# EasyEDA Pro project MP3416_DC-DC_5V.eprj

# Schematic MP3416_DC-DC
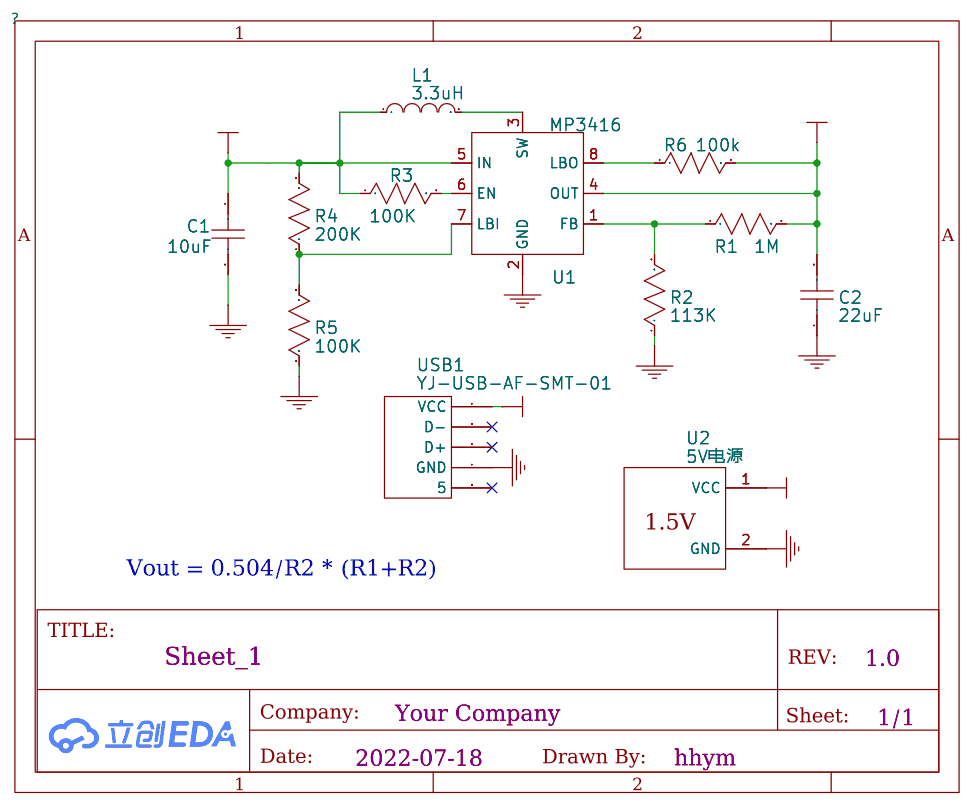
[diagram p0: schematic sheet]

## Parts
C1  10uF
C2  22uF
L1  3.3uH
R1  1M
R2  113K
R3  100K
R4  200K
R5  100K
R6  100k
U1  MP3416
U2  5V电源
USB1  YJ-USB-AF-SMT-01

## Library data of the parts
C1 C2 R1-R6 = undefined
L1 = undefined: Supplier: LCSC; Supplier Part: C718408; Manufacturer: YJYCOIN; Manufacturer Part: YSPI1365-3R3M; JLCPCB Part Class: Extended Part
U1 U2 = undefined: Supplier: LCSC
USB1 = undefined: Supplier: LCSC; Manufacturer: ValuePro; Supplier Part: C8328; JLCPCB Part Class: Extended Part

## Nets
+1.5V: C1.1 L1.1 R3.1 R4.2 U1.5(IN) U2.1(VCC)
+5V: C2.2 R1.2 R6.2 U1.4(OUT) USB1.1(VCC)
GND: C1.2 C2.1 R2.1 R5.1 U1.2(GND) U2.2(GND) USB1.4(GND)
Net-(L1-2): L1.2 U1.3(SW)
Net-(R1-1): R1.1 R2.2 U1.1(FB)
Net-(R3-2): R3.2 U1.6(EN)
Net-(R4-1): R4.1 R5.2 U1.7(LBI)
Net-(R6-1): R6.1 U1.8(LBO)

Not connected (* = marked no-connect by the designer): USB1 2(D-)* 3(D+)* 5*

## Notes on the sheet
- Vout = 0.504/R2 * (R1+R2)

# Board PCB_PCB_MP3416_DC-DC_2022-07-20
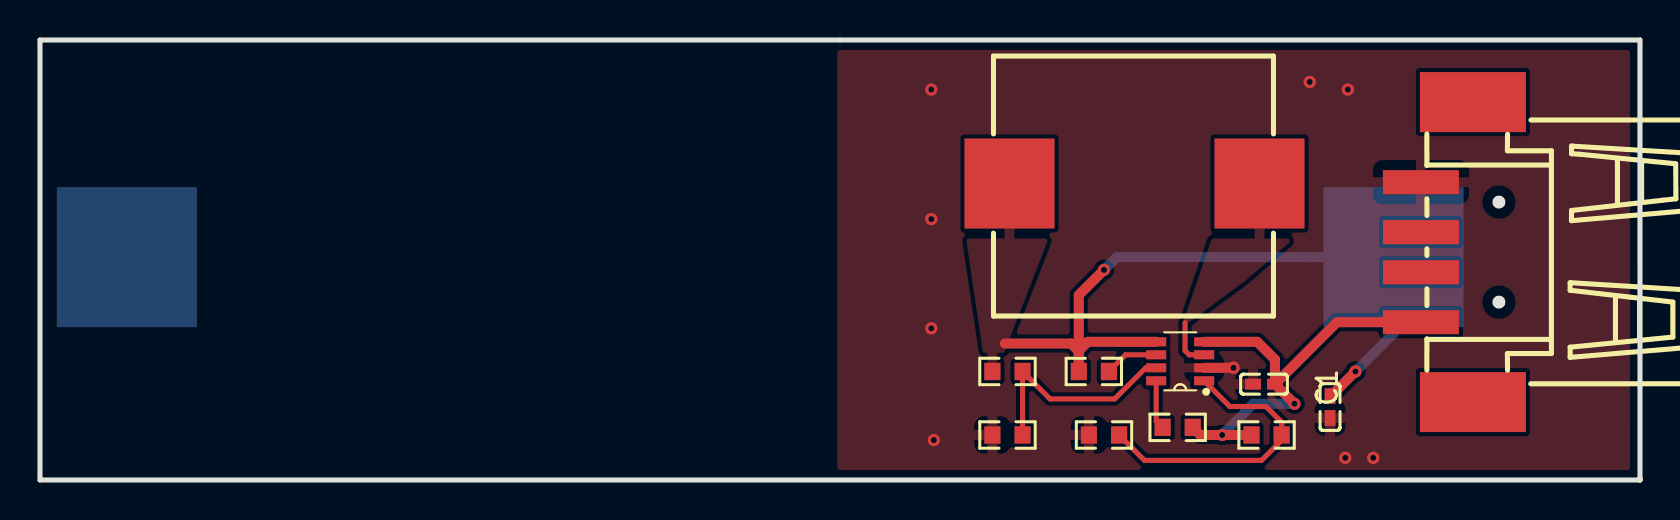
[diagram p1: board, top side]
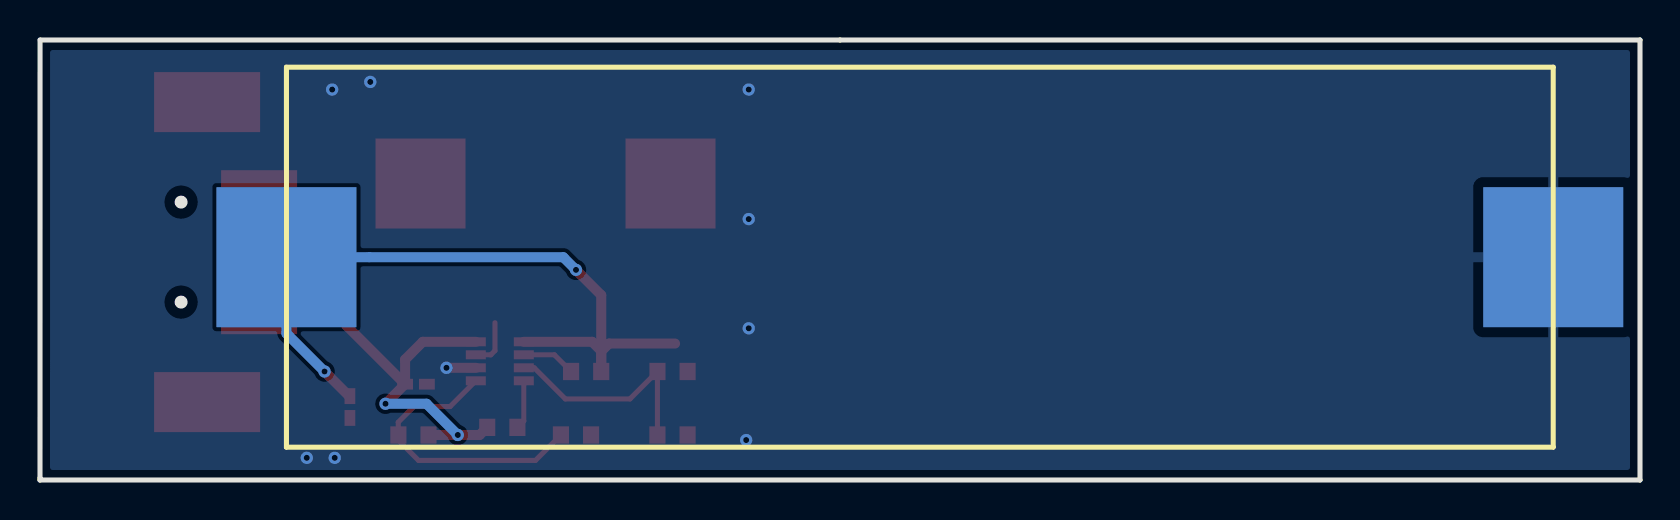
[diagram p2: board, bottom side, seen from below]

Outline 80 x 22 mm; copper layers: Top Layer, Bottom Layer. Coordinates in mm from the lower left corner of the outline.
Outline path: 80,0.11 80,0 80,22 0,22 0,0 80,0
Stack: Top Layer 0.035mm / Dielectric1 1.51mm FR4 er 4.5 / Bottom Layer 0.035mm

## Design rules (mm)
spacing Default (default): track to track 0.152, other pairs 0 to 0.152
track width Default (default): min 0.254, default 0.254, max 25.4
differential pair differentialPair (default): width min 0.127, default 0.254, max 2.54; gap min 0.152, default 0.152
via Default (default): diameter min 0.61, default 0.61, max 100.025; hole min 0.305, default 0.305, max 59.995
net GND uses gge5934
net U1_3 uses gge4255
net +1.5V uses gge4285
pour e9 uses gge6006(1)
pour e54 uses gge4255
pour e55 uses gge4285
pour e56 uses gge5934

## Placement (name value [footprint] x y rotation side)
C1  10uF  [unnamed#3]  64.5 3.65 270 top
C2  22uF  [unnamed#3]  61.2 4.79 0 top
L1  3.3uH  [unnamed#4]  54.72 14.82 0 top
R1  1M  [unnamed#5]  61.33 2.25 180 top
R2  113K  [unnamed#5]  53.2 2.25 0 top
R3  100K  [unnamed#5]  52.69 5.43 0 top
R4  200K  [unnamed#5]  48.37 5.43 180 top
R5  100K  [unnamed#5]  48.37 2.25 0 top
R6  100k  [unnamed#5]  56.88 2.63 0 top
U1  MP3416  [unnamed#2]  57.01 5.93 180 top
U2  5V电源  [unnamed#6]  67.68 11.14 180 bottom
USB1  YJ-USB-AF-SMT-01  [unnamed]  70.34 11.39 90 top

## Footprints (pads in the part's own frame, mm; a bottom-side part is the same pattern mirrored in y, then rotated)
unnamed
  rect 1.2x3.8 smd: 1(-3.505,1.3) 2(-1.005,1.3) 3(0.997,1.3) 4(3.495,1.3)
  rect 3x5.3 smd: 5(-7.5,-1.3) 6(7.5,-1.3)
unnamed#2
  rect 1x0.45 smd: 1(-1.2,0.975) 2(-1.2,0.325) 3(-1.2,-0.325) 4(-1.2,-0.975) 5(1.2,-0.975) 6(1.2,-0.325) 7(1.2,0.325) 8(1.2,0.975)
unnamed#3
  rect 0.79x0.54 smd: 1(-0.545,0) 2(0.545,0)
unnamed#4
  rect 4.5x4.5 smd: 1(-6.25,0) 2(6.25,0)
unnamed#5
  rect 0.806x0.864 smd: 1(-0.753,0) 2(0.753,0)
unnamed#6
  rect 7x7 smd: 1(0,0) 2(63.34,0)

## Nets
+1.5V: C1.1 L1.1 R3.1 R4.2 U1.5 U2.1
+5V: C2.2 R1.2 R6.2 U1.4 USB1.1
GND: C1.2 C2.1 R2.1 R5.1 U1.2 U2.2 USB1.4
U1_1: R1.1 R2.2 U1.1
U1_3: L1.2 U1.3
U1_6: R3.2 U1.6
U1_7: R4.1 R5.2 U1.7
U1_8: R6.1 U1.8

Pads without a net: USB1 2 3 5 6

## Via types
v1: diameter 0.613, hole 0.305, Top Layer to Bottom Layer, 10 vias
v2: diameter 0.615, hole 0.305, Top Layer to Bottom Layer, 3 vias

## Routing (per net, layer and track width the routed paths; a pad name or vN(x,y) marks a point on that pad's centre or on a via; arc(x,y) is an arc through that point)
+1.5V: length 37.5
  Top Layer w0.5: 51.94,6.46 52.39,6.91 U1.5 ; C1.1 64.54,4.19 v2(65.77,5.43) ; 48.25,6.82 51.55,6.82 51.94,6.43 R3.1 51.94,9.25 v1(53.2,10.51)
  Bottom Layer w0.5: v1(53.2,10.51) 53.84,11.14 U2.1 67.68,7.33 v2(65.77,5.43)
+5V: length 22.5
  Top Layer w0.5: R6.2 58.02,2.25 v1(59.11,2.25) R1.2 ; 61.75,4.79 64.85,7.89 USB1.1 ; 61.75,4.79 v1(62.72,3.81) ; 61.75,4.79 61.75,6.02 60.86,6.91 U1.4
  Bottom Layer w0.5: v1(59.11,2.25) 60.67,3.81 v1(62.72,3.81)
GND: length 1.5
  Top Layer w0.5: 59.68,5.68 v1(59.68,5.61) U1.2
  vias: v1(44.56,19.52) v1(44.56,13.05) v1(44.56,7.58) v1(44.69,2) v1(65.27,1.11) v1(65.39,19.52) v2(63.49,19.9) v2(66.66,1.11)
U1_1: length 14.7
  Top Layer w0.254: 58.21,4.96 59.49,3.67 61.3,3.67 62.09,2.89 62.08,2.25 62.09,2 61.07,0.98 55.22,0.98 53.95,2.25
U1_3: length 2.4
  Top Layer w0.254: 58.21,6.26 57.46,6.26 57.25,6.47 57.25,7.86
U1_6: length 2.7
  Top Layer w0.254: 53.45,5.43 54.28,6.26 U1.6
U1_7: length 11.1
  Top Layer w0.254: 49.13,2.25 49.13,5.43 ; U1.7 55.29,5.61 53.73,4.05 50.5,4.05 49.13,5.43
U1_8: length 2.5
  Top Layer w0.254: 56.13,2.63 55.81,2.95 U1.8

## Copper pours and planes (outline as drawn; the poured copper is in the pictures)
+1.5V on Top Layer: 47.23,5.81 46.22,12.66 50.66,12.66 47.99,5.81
GND on Top Layer: 89.27,28.79 89.27,-6.13 39.87,-6.13 39.87,28.79
GND on Bottom Layer: 89.4,30.19 89.4,-10.07 -6.87,-10.07 -6.36,30.19
U1_3 on Top Layer: 57.14,7.84 58.79,12.66 63.23,12.66 63.23,12.54 60.31,10 57.39,7.84 57.26,7.71

Small or netless copper shapes (teardrops, artwork), in the pictures only: 1 on Bottom Layer
